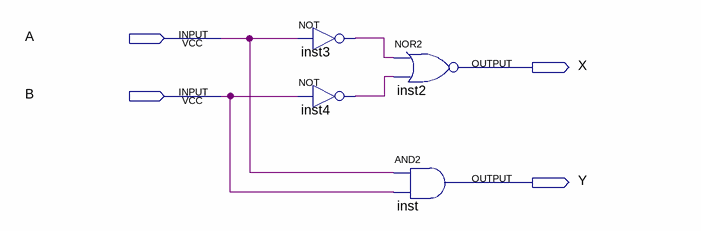
[diagram p0: schematic sheet]
// Quartus schematic ex1.bdf as structural Verilog: 4 symbols, 4 pins
module ex1 (
  input  A,
  input  B,
  output X,
  output Y
);

  wire inst3_out, inst4_out;

  not inst3 (inst3_out, A);
  not inst4 (inst4_out, B);
  nor inst2 (X, inst3_out, inst4_out);
  and inst (Y, A, B);
endmodule
